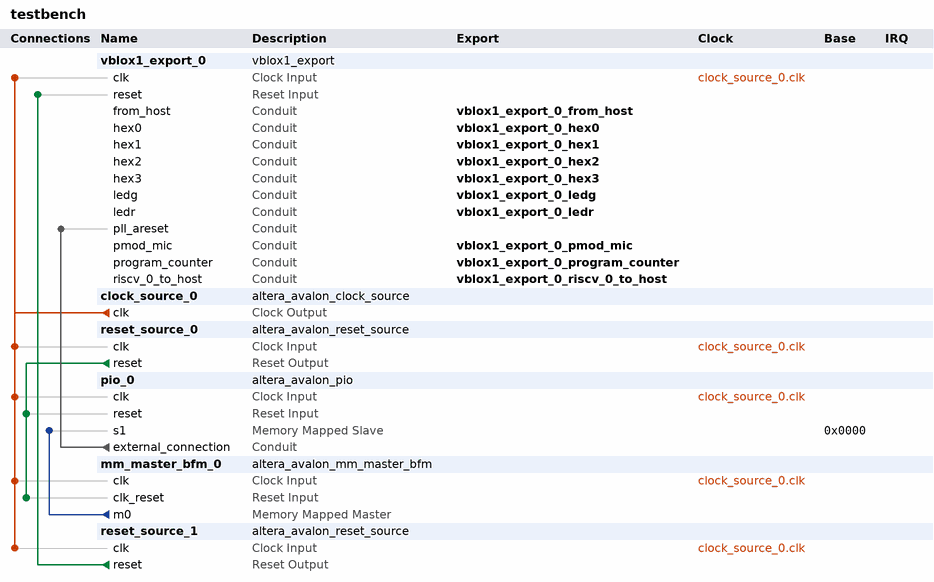
[diagram p0: system contents]
# Platform Designer (Qsys) system testbench, Cyclone IV E EP4CE115F29C7
# Parameters at their usual value, and those the tool derives, are not listed.
package require -exact qsys 15.0
create_system testbench
set_project_property DEVICE_FAMILY {Cyclone IV E}
set_project_property DEVICE EP4CE115F29C7

add_instance vblox1_export_0 vblox1_export 1.0

add_instance clock_source_0 altera_avalon_clock_source 15.0
set_instance_parameter_value clock_source_0 CLOCK_RATE 50
set_instance_parameter_value clock_source_0 CLOCK_UNIT 1000000

add_instance reset_source_0 altera_avalon_reset_source 15.0
set_instance_parameter_value reset_source_0 ASSERT_HIGH_RESET 1
set_instance_parameter_value reset_source_0 INITIAL_RESET_CYCLES 2

add_instance pio_0 altera_avalon_pio 15.0
set_instance_parameter_value pio_0 direction Output
set_instance_parameter_value pio_0 width 1

add_instance mm_master_bfm_0 altera_avalon_mm_master_bfm 15.0
set_instance_parameter_value mm_master_bfm_0 ADDRESS_UNITS SYMBOLS
set_instance_parameter_value mm_master_bfm_0 AV_ADDRESS_W 32
set_instance_parameter_value mm_master_bfm_0 AV_ALWAYS_BURST_MAX_BURST 0
set_instance_parameter_value mm_master_bfm_0 AV_BURSTCOUNT_W 3
set_instance_parameter_value mm_master_bfm_0 AV_BURST_BNDR_ONLY 1
set_instance_parameter_value mm_master_bfm_0 AV_BURST_LINEWRAP 1
set_instance_parameter_value mm_master_bfm_0 AV_CONSTANT_BURST_BEHAVIOR 1
set_instance_parameter_value mm_master_bfm_0 AV_FIX_READ_LATENCY 1
set_instance_parameter_value mm_master_bfm_0 AV_MAX_PENDING_WRITES 0
set_instance_parameter_value mm_master_bfm_0 AV_NUMSYMBOLS 4
set_instance_parameter_value mm_master_bfm_0 AV_READRESPONSE_W 8
set_instance_parameter_value mm_master_bfm_0 AV_READ_WAIT_TIME 1
set_instance_parameter_value mm_master_bfm_0 AV_WRITERESPONSE_W 8
set_instance_parameter_value mm_master_bfm_0 USE_BURSTCOUNT 1
set_instance_parameter_value mm_master_bfm_0 USE_BYTE_ENABLE 1
set_instance_parameter_value mm_master_bfm_0 USE_READ 1
set_instance_parameter_value mm_master_bfm_0 USE_READ_DATA 1
set_instance_parameter_value mm_master_bfm_0 USE_READ_DATA_VALID 1
set_instance_parameter_value mm_master_bfm_0 USE_WAIT_REQUEST 1
set_instance_parameter_value mm_master_bfm_0 USE_WRITE 0
set_instance_parameter_value mm_master_bfm_0 USE_WRITE_DATA 0
set_instance_parameter_value mm_master_bfm_0 VHDL_ID 0

add_instance reset_source_1 altera_avalon_reset_source 15.0
set_instance_parameter_value reset_source_1 ASSERT_HIGH_RESET 1
set_instance_parameter_value reset_source_1 INITIAL_RESET_CYCLES 10

# connections
add_connection clock_source_0.clk mm_master_bfm_0.clk clock
add_connection clock_source_0.clk pio_0.clk clock
add_connection clock_source_0.clk reset_source_0.clk clock
add_connection clock_source_0.clk reset_source_1.clk clock
add_connection clock_source_0.clk vblox1_export_0.clk clock
add_connection reset_source_0.reset mm_master_bfm_0.clk_reset reset
add_connection reset_source_0.reset pio_0.reset reset
add_connection reset_source_1.reset vblox1_export_0.reset reset
add_connection mm_master_bfm_0.m0 pio_0.s1 avalon
set_connection_parameter_value mm_master_bfm_0.m0/pio_0.s1 baseAddress 0x0000
add_connection pio_0.external_connection vblox1_export_0.pll_areset conduit

# exported interfaces
add_interface vblox1_export_0_from_host conduit end
set_interface_property vblox1_export_0_from_host EXPORT_OF vblox1_export_0.from_host
add_interface vblox1_export_0_hex0 conduit end
set_interface_property vblox1_export_0_hex0 EXPORT_OF vblox1_export_0.hex0
add_interface vblox1_export_0_hex1 conduit end
set_interface_property vblox1_export_0_hex1 EXPORT_OF vblox1_export_0.hex1
add_interface vblox1_export_0_hex2 conduit end
set_interface_property vblox1_export_0_hex2 EXPORT_OF vblox1_export_0.hex2
add_interface vblox1_export_0_hex3 conduit end
set_interface_property vblox1_export_0_hex3 EXPORT_OF vblox1_export_0.hex3
add_interface vblox1_export_0_ledg conduit end
set_interface_property vblox1_export_0_ledg EXPORT_OF vblox1_export_0.ledg
add_interface vblox1_export_0_ledr conduit end
set_interface_property vblox1_export_0_ledr EXPORT_OF vblox1_export_0.ledr
add_interface vblox1_export_0_pmod_mic conduit end
set_interface_property vblox1_export_0_pmod_mic EXPORT_OF vblox1_export_0.pmod_mic
add_interface vblox1_export_0_program_counter conduit end
set_interface_property vblox1_export_0_program_counter EXPORT_OF vblox1_export_0.program_counter
add_interface vblox1_export_0_riscv_0_to_host conduit end
set_interface_property vblox1_export_0_riscv_0_to_host EXPORT_OF vblox1_export_0.riscv_0_to_host

set_interconnect_requirement {$system} qsys_mm.clockCrossingAdapter HANDSHAKE
set_interconnect_requirement {$system} qsys_mm.enableEccProtection FALSE
set_interconnect_requirement {$system} qsys_mm.insertDefaultSlave FALSE
set_interconnect_requirement {$system} qsys_mm.maxAdditionalLatency 1

save_system testbench.qsys
